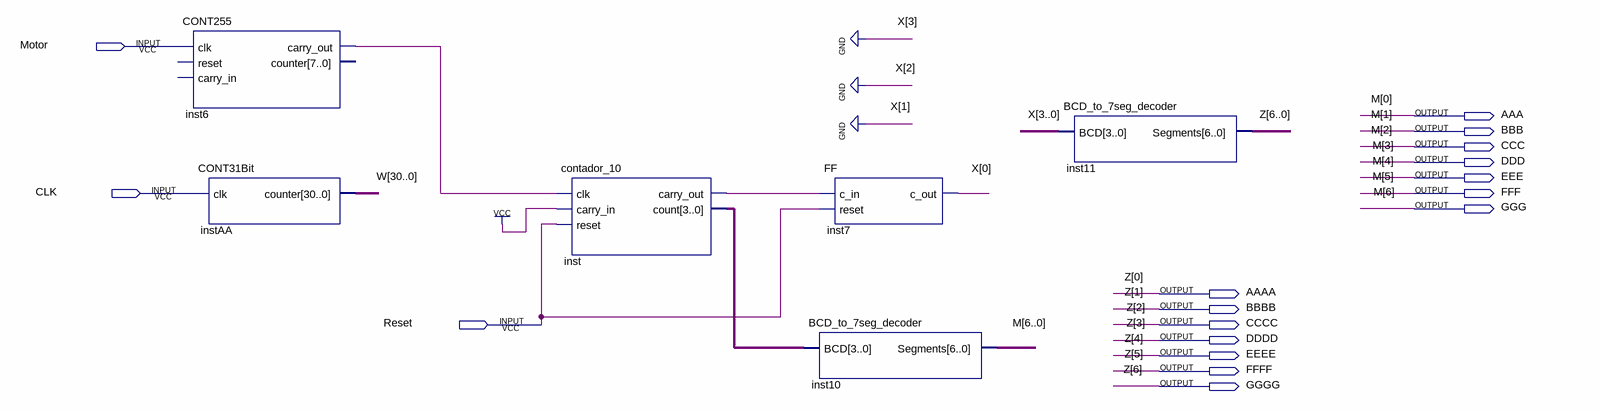
[diagram p0: schematic sheet]
// Quartus schematic ODO.bdf as structural Verilog: 6 symbols, 17 pins
module ODO (
  input  Motor,
  input  CLK,
  input  Reset,
  output AAA,
  output BBB,
  output CCC,
  output DDD,
  output EEE,
  output FFF,
  output GGG,
  output AAAA,
  output BBBB,
  output CCCC,
  output DDDD,
  output EEEE,
  output FFFF,
  output GGGG
);

  wire inst6_carry_out, inst_carry_out;
  wire [0:0] X;
  wire [3:0] inst_count;
  wire [30:0] W;

  CONT255 inst6 (.clk(Motor), .carry_out(inst6_carry_out));  // open: reset, carry_in, counter
  CONT31Bit instAA (.clk(CLK), .counter(W));
  contador_10 inst (
    .clk(inst6_carry_out), .carry_in(1'b1), .reset(Reset), .carry_out(inst_carry_out), .count(inst_count));
  FF inst7 (.c_in(inst_carry_out), .reset(Reset), .c_out(X[0]));
  BCD_to_7seg_decoder inst10 (.BCD(inst_count), .Segments({GGG, FFF, EEE, DDD, CCC, BBB, AAA}));
  BCD_to_7seg_decoder inst11 (.BCD({3'b000, X[0]}), .Segments({GGGG, FFFF, EEEE, DDDD, CCCC, BBBB, AAAA}));

  // Other names for the same wires on the sheet: M[6:0] = {GGG, FFF, EEE, DDD, CCC, BBB, AAA};
  //   Z[6:0] = {GGGG, FFFF, EEEE, DDDD, CCCC, BBBB, AAAA}
endmodule
